# Altium schematic sheet main_schematic.SchDoc
size A; SheetNumber: 1; SheetTotal: 1
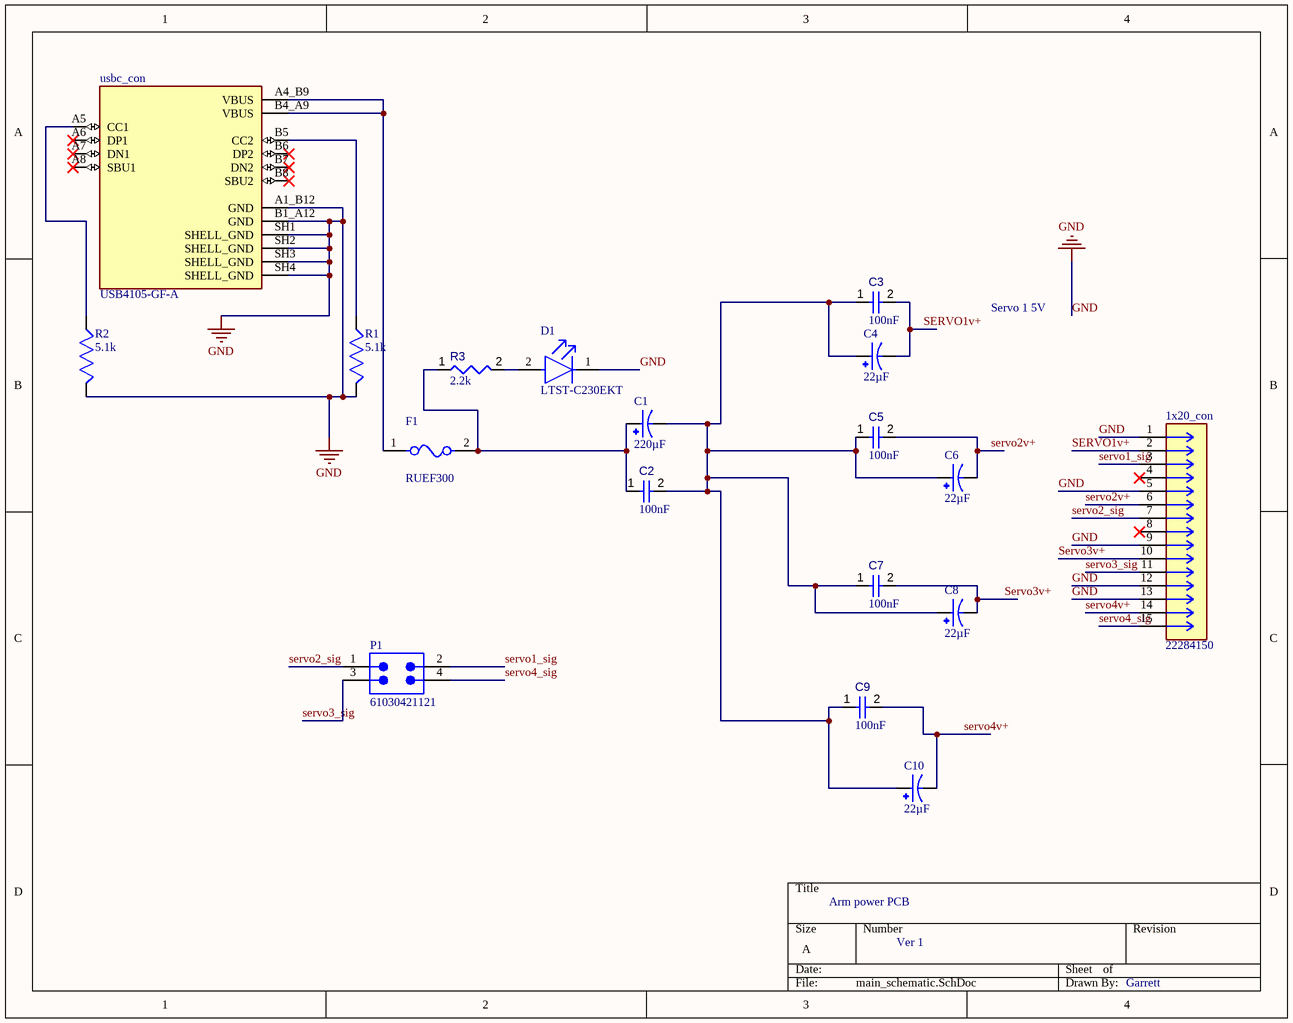
[diagram p0: main_schematic.SchDoc]

## Parts
1x20_con  22284150  [CONN_SD-42375-001_M240_15_MOL]
C1  value 220µF  [CAP_EEEHD1A221AP]  (hidden comment: EEEHD1A221AP)
C2  value 100nF  [CAPC0402(1005)60_L]  (hidden comment: Capacitor 100nF +/-20% 50V 0402)
C3  value 100nF  [CAPC0402(1005)60_L]  (hidden comment: Capacitor 100nF +/-20% 50V 0402)
C4  value 22µF  [CAPPRD200W45D500H500]  (hidden comment: ECEA1CKS220)
C5  value 100nF  [CAPC0402(1005)60_L]  (hidden comment: Capacitor 100nF +/-20% 50V 0402)
C6  value 22µF  [CAPPRD200W45D500H500]  (hidden comment: ECEA1CKS220)
C7  value 100nF  [CAPC0402(1005)60_L]  (hidden comment: Capacitor 100nF +/-20% 50V 0402)
C8  value 22µF  [CAPPRD200W45D500H500]  (hidden comment: ECEA1CKS220)
C9  value 100nF  [CAPC0402(1005)60_L]  (hidden comment: Capacitor 100nF +/-20% 50V 0402)
C10  value 22µF  [CAPPRD200W45D500H500]  (hidden comment: ECEA1CKS220)
D1  LTST-C230EKT  [FP-LTST-C230EKT-MFG]
F1  RUEF300  [FP-RUEF300-MFG]
P1  61030421121  [61030421121]
R1  value 5.1k  [RESC1005X40]  (hidden comment: RC0402FR-135K1L)
R2  value 5.1k  [RESC1005X40]  (hidden comment: RC0402FR-135K1L)
R3  value 2.2k  [RESC0402(1005)_L]  (hidden comment: 2D2KR2J)
usbc_con  USB4105-GF-A  [GCT_USB4105-GF-A]

## Nets
GND: 1x20_con.1 1x20_con.5 1x20_con.9 1x20_con.12 1x20_con.13 D1.1(C) R1.1 R2.1 usbc_con.A1_B12(GND) usbc_con.B1_A12(GND) usbc_con.SH1(SHELL_GND) usbc_con.SH2(SHELL_GND) usbc_con.SH3(SHELL_GND) usbc_con.SH4(SHELL_GND)
servo1_sig: 1x20_con.3 P1.2
SERVO1v+: 1x20_con.2 C3.2 C4.N
servo2_sig: 1x20_con.7 P1.1
servo2v+: 1x20_con.6 C5.2 C6.N
servo3_sig: 1x20_con.11 P1.3
Servo3v+: 1x20_con.10 C7.2 C8.N
servo4_sig: 1x20_con.15 P1.4
servo4v+: 1x20_con.14 C9.2 C10.N
NetC1_1: C1.1 C2.1 F1.2 R3.1
NetC1_2: C1.2 C2.2 C3.1 C4.P C5.1 C6.P C7.1 C8.P C9.1 C10.P
NetD1_2: D1.2(A) R3.2
NetF1_1: F1.1 usbc_con.A4_B9(VBUS) usbc_con.B4_A9(VBUS)
NetR1_2: R1.2 usbc_con.B5(CC2)
NetR2_2: R2.2 usbc_con.A5(CC1)

Not connected (* = marked no-connect by the designer): 1x20_con 4* 8*; usbc_con A6(DP1)* A7(DN1)* A8(SBU1)* B6(DP2)* B7(DN2)* B8(SBU2)*

## Notes on the sheet
- Servo 1 5V
- Arm power PCB
- Ver 1
- Garrett

## Library data of the parts
1x20_con = CMP-002-00073-1: 2.54mm Pitch KKÂ® Header, Breakaway, Vertical, 15 Circuits, Tin (Sn) Plating, Mating Pin Length 6.09mm; MF: Molex; Case/Package: None; Value: *; Source: 22284150.SchLib; SnapEDA_Link: https://www.snapeda.com/parts/22284150/Molex/view-part/?ref=snap; Component Type: Standard; MP: 22284150; Pins: 15; Design Item ID: 22284150; Check_prices: https://www.snapeda.com/parts/22284150/Molex/view-part/?ref=eda
C1 = CMP-001-00084-1: Tá»¥ Ä‘iá»‡n phÃ¢n nhÃ´m 220ÂµF 10V hÆ°á»›ng tÃ¢m, cÃ³ thá»ƒ - SMD 5000 giá» á»Ÿ 105Â°C; MF: Panasonic; Component Type: Standard; Case/Package: RADIAL-2 Panasonic; Design Item ID: EEEHD1A221AP; MP: EEEHD1A221AP; Pins: 2; SnapEDA_Link: https://www.snapeda.com/parts/EEEHD1A221AP/Panasonic/view-part/?ref=snap; Check_prices: https://www.snapeda.com/parts/EEEHD1A221AP/Panasonic/view-part/?ref=eda; Source: EEEHD1A221AP.SchLib
C2 C3 C5 C7 C9 = CMP-001-00067-3: Chip Capacitor, 100nF +/-20%, 50V, 0402, Thickness 0.6 mm; Tolerance: 10%; Min Operating Temperature: -55°C; Pins: 2; Case/Package: 0402; Max Operating Temperature: 85°C; Voltage Rating: 50V; Mounting Technology: SMT
C4 C6 C8 C10 = CMP-001-00083-1: Capacitor; Aluminum Electrolytic; Cap 22uF; Vol-Rtg 16V; Radial; Ks; Height 5mm; MF: Panasonic; MP: ECE-A1CKS220; Purchase-URL: https://pricing.snapeda.com/search/part/ECE-A1CKS220/?ref=eda; SnapEDA_Link: https://www.snapeda.com/parts/ECE-A1CKS220/Panasonic/view-part/2301577/?ref=snap; Component Type: Standard; Design Item ID: ECEA1CKS220; Case/Package: RADIAL-2 Panasonic; Check_prices: https://www.snapeda.com/parts/ECE-A1CKS220/Panasonic/view-part/2301577/?ref=eda; Source: ECEA1CKS220.SchLib; Availability: In Stock; Pins: 2; Price: None
D1 = CMP-22017-000030-1: LED RED CLEAR CHIP SMD; Forward Current: 30mA; Test Current: 10mA; Number of Elements: 1; Viewing Angle: 130°; Dominant Wavelength: 621nm; Forward Voltage: 2V; Lens Style: Diffused; Power Rating: 100mW; Reverse Voltage: 5V; Wavelength: 630nm; Luminous Intensity: 6mcd; Lens Color: Colorless; Case/Package: 1206; Case Code (Imperial): 1206; Package Quantity: 1; Lead Free: Lead Free; Case Code (Metric): 3216; Height: 1.1mm; Lens Transparency: Clear; Mount: Surface Mount; Depth: 1.6mm; Number of LEDs: 1; Power Dissipation: 100mW; Max Operating Temperature: 85°C; Width: 1.6mm; Color: Red; Number of Pins: 2; Min Operating Temperature: -55°C; Packaging: Tape and Reel; Radiation Hardening: No; Illumination Color: Red; Length: 3.2mm
F1 = CMP-08606-000026-1: PTC RESET FUSE 30V 3A RADIAL; Manufacturer: Littelfuse; Trip Time: 10.8s; Trip Current: 6A; Current Rating: 100A; Value: 0.02-0.08Ω; Device Class L3: unset; Temperature Range Low: -40°C; ComponentLink2Description: Datasheet; Height: 16.5mm; Package: 0; Manufacturer Part Number: RUEF300; Category: Fuse; Digikey Description: PTC RESET FUSE 30V 3A RADIAL; Device Class L2: PTC Resettable Fuses; RoHS: TRUE; ComponentLink2URL: https://www.littelfuse.com/~/media/electronics/datasheets/resettable_ptcs/littelfuse_ptc_radial_leaded_ruef_datasheet.pdf.pdf; Temperature: -40°C to +85°C; Automotive: No; Hold Current: 3A; Device Class L1: Circuit Protection; Voltage Rating: 30V; Ambient Temperature Range Low: -40°C; Lead Free: Yes; Octopart: https://octopart.com/ruef300-littelfuse-74215783; Resistance: 0.02-0.08Ω; Ambient Temperature Range High: +85°C; Temperature Range High: +85°C
P1 = CMP-1502-01050-4: SMT Vertical Pin Header WR-PHD, Pitch 2.54 mm, Dual Row, 4 pins; Operating Supply Voltage: 250V; Connector Type: Male Pin; Number of Contacts: 4; Gender: Male; Pitch: 2.54mm; Current Rating: 3A; Contact Resistance: 20mΩ; Number of Rows: 2; Mount: Surface Mount; Contact Material: Copper; Contact Mating Length: 5.9944mm; Lead Pitch: 2.54mm; Termination: Solder; Color: Black; Orientation: Vertical; Packaging: Tape and Reel; Number of Pins: 4; Contact Plating: Gold; Row Spacing: 2.54mm; RoHS: Compliant; Number of Positions: 4
R1 R2 = CMP-009-00177-1: Res Thick Film 0402 5.1K Ohm 1% 1/16W Â±100ppm/Â°C Molded SMD SMD Paper T/R; MF: Yageo; Component Type: Standard; Check_prices: https://www.snapeda.com/parts/RC0402FR-135K1L/Yageo/view-part/?ref=eda; Pins: 2; Case/Package: SMD-2 Yageo; Source: RC0402FR-135K1L.SchLib; Design Item ID: RC0402FR-135K1L; MP: RC0402FR-135K1L; SnapEDA_Link: https://www.snapeda.com/parts/RC0402FR-135K1L/Yageo/view-part/?ref=snap
R3 = CMP-009-00087-2: 2K2 0.063W 5% 0402 (1005 Metric)  SMD; Power: 63mW; Mounting Technology: SMT; Tolerance: 5%; Case/Package: 0402; Pins: 2
usbc_con = CMP-002-00072-1: MF: {'manufacturer': u'GCT'}; Price: None; MP: USB4105-GF-A; Value: *; Pins: 16; Availability: Unavailable; Case/Package: None; Design Item ID: USB4105-GF-A; Component Type: Standard; Source: USB4105-GF-A.SchLib